# EAGLE design JoyPad (EAGLE 7.2.0)
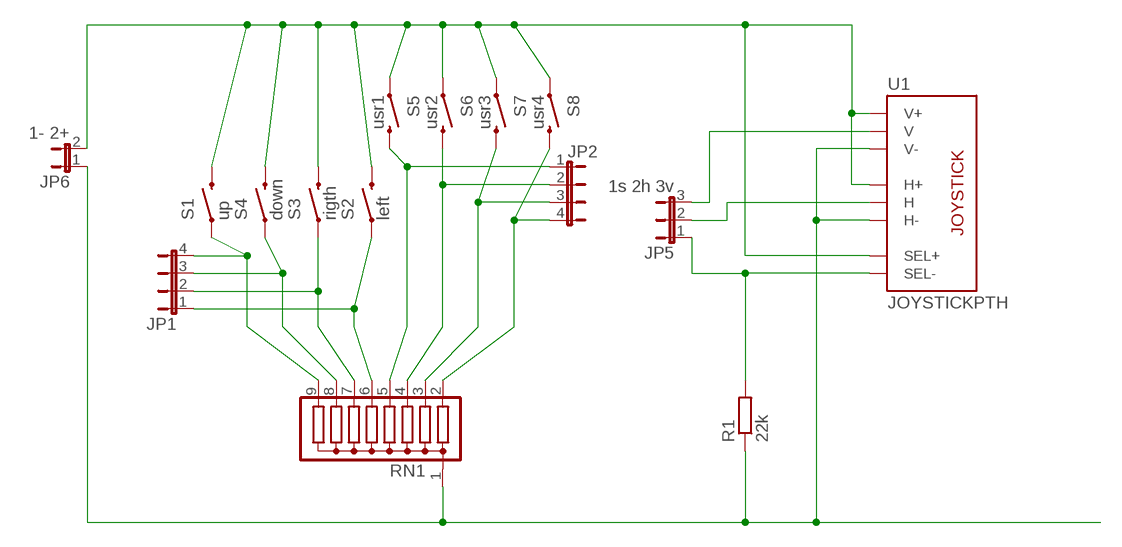
[diagram p0: schematic, sheet 1]

## Parts
JP1  JP4E  [JP4]
JP2  JP4E  [JP4]
JP5  1s 2h 3v  JP2E  [JP2]
JP6  1- 2+  JP1E  [JP1]
R1  22k  R-EU_0207/15  [0207/15]
RN1  G08R  [SIL9]
S1  up  SWITCH-MOMENTARY-2PTH  [TACTILE-PTH]
S2  left  SWITCH-MOMENTARY-2PTH  [TACTILE-PTH]
S3  rigth  SWITCH-MOMENTARY-2PTH  [TACTILE-PTH]
S4  down  SWITCH-MOMENTARY-2PTH  [TACTILE-PTH]
S5  usr1  SWITCH-MOMENTARY-2PTH  [TACTILE-PTH]
S6  usr2  SWITCH-MOMENTARY-2PTH  [TACTILE-PTH]
S7  usr3  SWITCH-MOMENTARY-2PTH  [TACTILE-PTH]
S8  usr4  SWITCH-MOMENTARY-2PTH  [TACTILE-PTH]
U1  JOYSTICKPTH  [JOYSTICK]

## Nets
N$2: JP6.1 R1.1 RN1.1 U1.H3(H-) U1.V3(V-)
N$3: JP1.4 RN1.9 S1.1
N$4: JP1.3 RN1.8 S4.1
N$5: JP1.2 RN1.7 S3.1
N$6: JP1.1 RN1.6 S2.1
N$7: JP2.1 RN1.5 S5.3
N$8: JP2.2 RN1.4 S6.3
N$9: JP2.3 RN1.3 S7.3
N$10: JP2.4 RN1.2 S8.3
N$11: JP6.2 S1.3 S2.3 S3.3 S4.3 S5.1 S6.1 S7.1 S8.1 U1.B1A(SEL+) U1.H1(H+) U1.V1(V+)
N$13: JP5.1 R1.2 U1.B2A(SEL-)
N$14: JP5.3 U1.V2(V)
N$15: JP5.2 U1.H2(H)

## Library data of the parts
JP1 JP2 = jumper:JP4E: JUMPER
JP5 = jumper:JP2E: JUMPER
JP6 = jumper:JP1E: JUMPER
R1 = rcl:R-EU_: RESISTOR, European symbol
RN1 = resistor-sil:G08R: SIL RESISTOR; OC_FARNELL: unknown; OC_NEWARK: unknown
S1-S8 = SparkFun-Electromechanical:SWITCH-MOMENTARY-2: Various NO switches- pushbuttons, reed, etc; PROD_ID: SWCH-08441
U1 = adafruit:JOYSTICK: Thumb Joystick Joystick commonly found in PS2 controllers. Two pots and a select switch. Adapted from Sparkfun Library (but for more common 6mm switch sticks)

## Board
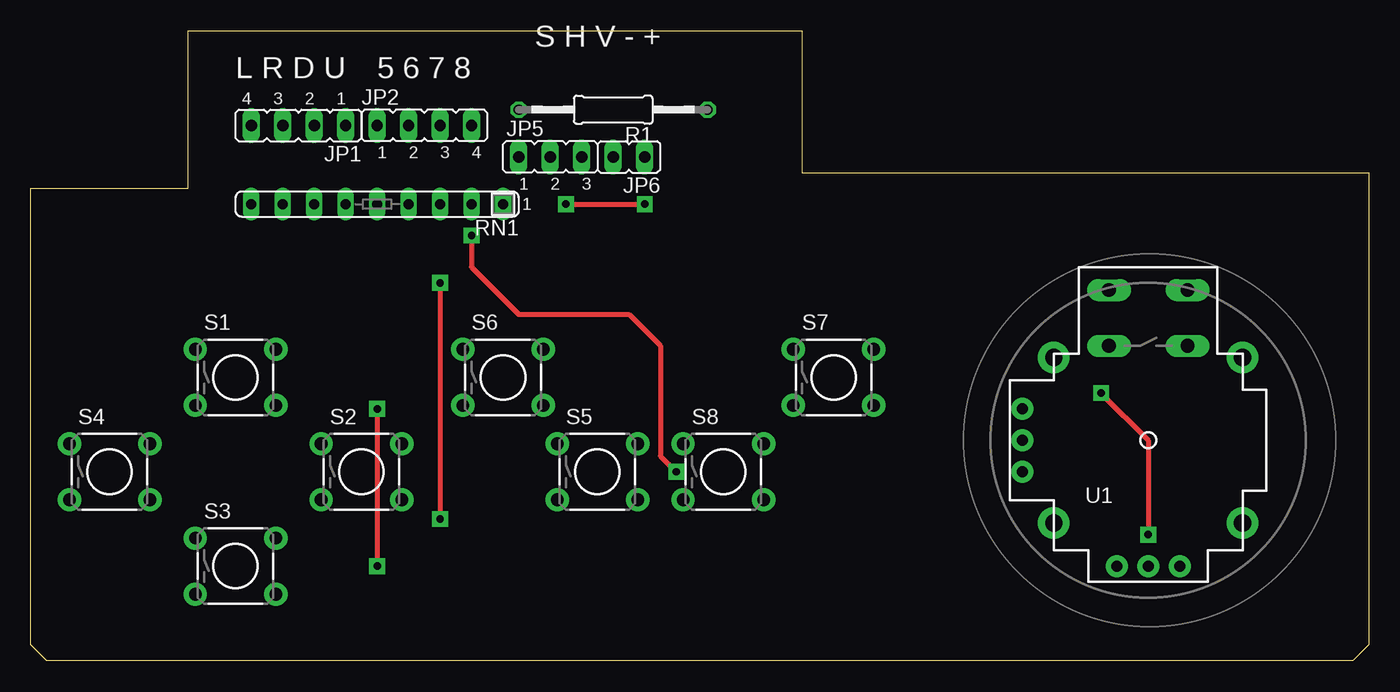
[diagram p1: board, top side]
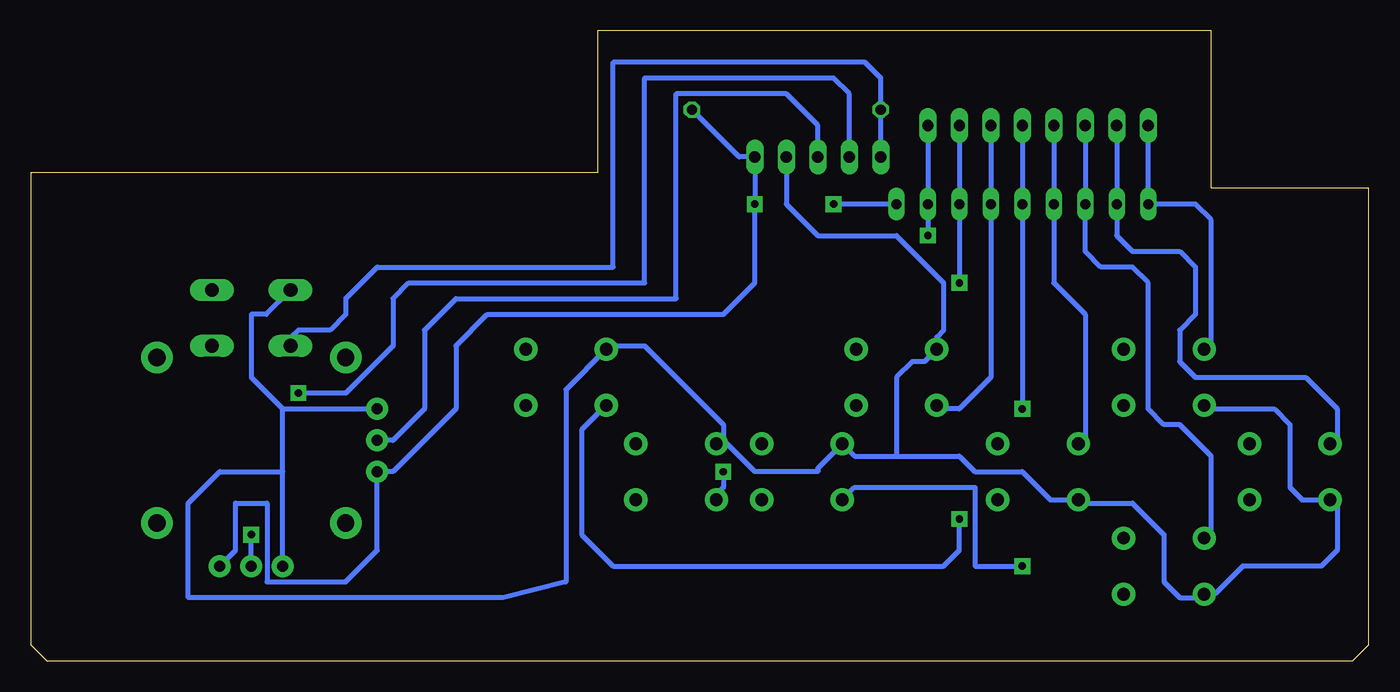
[diagram p2: board, bottom side, seen from below]

Size 107.95 x 50.8 mm. Coordinates in mm from the lower left corner, seen from the top.
Outline: 1.27,0 0,1.27 0,38.1 12.7,38.1 12.7,50.8 62.23,50.8 62.23,39.37 107.95,39.37 107.95,1.27 106.68,0 1.27,0
Copper layers (1*16): Top 0.035mm / dielectric 1.5mm / Bottom 0.035mm
Design rules "default": minimum track width 10mil, minimum drill 24mil, track to track 8mil, track to pad 8mil, pad to pad 8mil, via to via 8mil, smd to smd 8mil, copper to edge 40mil, drill to drill 8mil, minimum pad ring 10mil, minimum via ring 8mil, stop-mask expansion 4mil, vias tented up to drill 0mil, thermal gap 10mil

### Footprints (pad centres in the part's own frame; a part is rotated, then mirrored left to right if it is on the bottom)
JP4 = drill 0.914 long: 1 -3.81,0; 2 -1.27,0; 3 1.27,0; 4 3.81,0
JP2 = drill 0.914 long: 1 -2.54,0; 2 0,0; 3 2.54,0
JP1 = drill 0.914 long: 1 0,-1.27; 2 0,1.27
0207/15 = drill 0.813 octagon: 1 -7.62,0; 2 7.62,0
SIL9 = drill 0.813 long: 1 -10.16,0; 2 -7.62,0; 3 -5.08,0; 4 -2.54,0; 5 0,0; 6 2.54,0; 7 5.08,0; 8 7.62,0; 9 10.16,0
TACTILE-PTH = drill 1.016 pad 1.88: 1 -3.251,2.261; 2 3.251,2.261; 3 -3.251,-2.261; 4 3.251,-2.261
JOYSTICK = drill 1.1 pad 1.778 long: B1A -3.175,12.12; B1B 3.175,12.12; B2A -3.175,7.62; B2B 3.175,7.62 | drill 0.889 pad 1.778: H1 -2.54,-10.16; H2 0,-10.16; H3 2.54,-10.16; V1 -10.16,2.54; V2 -10.16,0; V3 -10.16,-2.54 | drill 1.397 pad 2.54: MOUNT1 -7.62,6.668; MOUNT2 -7.62,-6.668; MOUNT3 7.62,-6.668; MOUNT4 7.62,6.668

### Placement (x,y rotation side)
JP1  21.59,43.18 180 top
JP2  31.75,43.18 0 top
JP5  41.91,40.64 0 top
JP6  48.26,40.64 90 top
R1  46.99,44.45 180 top
RN1  27.94,36.83 180 top
S1  16.51,22.86 0 top
S2  26.67,15.24 0 top
S3  16.51,7.62 0 top
S4  6.35,15.24 0 top
S5  45.72,15.24 0 top
S6  38.1,22.86 0 top
S7  64.77,22.86 0 top
S8  55.88,15.24 0 top
U1  90.17,17.78 0 top

### Tracks (layer width: path | path; a pad name or v marks a point on that pad's centre or on a via)
N$2  (via drill 0.6 pad 1.27)
  Top 0.406: v43.18,36.83 v49.53,36.83
  Bottom 0.406: R1.1 50.8,40.64 JP6.1 v49.53,36.83 49.53,30.48 52.07,27.94 71.12,27.94 73.66,25.4 73.66,20.32 78.74,15.24 U1.V3 80.01,8.89 82.55,6.35 88.9,6.35 88.9,12.7 91.44,12.7 91.44,8.89 U1.H3 | RN1.1 v43.18,36.83
N$3
  Bottom 0.406: JP1.4 RN1.9 13.97,36.83 12.7,35.56 12.7,25.68 S1.1
N$4
  Bottom 0.406: JP1.3 RN1.8 20.32,34.29 19.05,33.02 15.24,33.02 13.97,31.75 13.97,27.94 15.24,26.67 15.24,24.13 13.97,22.86 5.08,22.86 2.54,20.32 2.54,17.78 2.82,17.5 S4.1
N$5
  Bottom 0.406: JP1.2 RN1.7 22.86,33.02 21.59,31.75 19.05,31.75 17.78,30.48 17.78,20.32 16.51,19.05 15.24,19.05 12.7,16.51 12.7,10.44 S3.1
N$6
  Bottom 0.406: JP1.1 RN1.6 25.4,30.48 22.86,27.94 22.86,17.78 23.14,17.5 S2.1
N$7  (via drill 0.6 pad 1.27)
  Top 0.406: v27.94,20.32 v27.94,7.62
  Bottom 0.406: JP2.1 RN1.5 v27.94,20.32 | S5.3 41.48,13.97 31.75,13.97 31.75,7.62 v27.94,7.62
N$8
  Bottom 0.406: JP2.2 RN1.4 30.48,22.86 33.02,20.32 34.29,20.32 34.57,20.6 S6.3
N$9  (via drill 0.6 pad 1.27)
  Top 0.406: v33.02,30.48 v33.02,11.43
  Bottom 0.406: JP2.3 RN1.3 v33.02,30.48 | S7.3 63.5,18.62 63.5,10.16 60.96,7.62 34.29,7.62 33.02,8.89 v33.02,11.43
N$10  (via drill 0.6 pad 1.27)
  Top 0.406: v35.56,34.29 35.56,31.75 39.37,27.94 48.26,27.94 50.8,25.4 50.8,16.51 v52.07,15.24
  Bottom 0.406: JP2.4 RN1.2 v35.56,34.29 | v52.07,15.24 52.07,13.97 52.63,13.41 S8.3
N$11
  Bottom 0.406: S1.3 12.98,20.32 7.62,20.32 6.35,19.05 6.35,13.97 5.36,12.98 S4.3 2.54,12.42 2.54,8.89 3.81,7.62 10.16,7.62 12.42,5.36 S3.3 12.98,5.36 12.7,5.08 15.24,5.08 16.51,6.35 16.51,10.16 19.05,12.7 23.14,12.7 S2.3 25.68,12.98 27.94,15.24 31.75,15.24 33.02,16.51 38.1,16.51 | 38.1,16.51 41.48,16.51 S5.1 44.45,15.52 44.45,15.24 49.53,15.24 51.79,17.5 52.07,17.5 | 38.1,16.51 38.1,22.86 36.83,24.13 35.84,24.13 S6.1 34.85,26.11 34.29,26.67 34.29,30.48 38.1,34.29 44.45,34.29 46.99,36.83 JP6.2 | 52.07,17.5 S8.1 | 52.07,17.5 52.07,19.05 58.42,25.4 61.24,25.4 S7.1 64.77,21.87 64.77,6.35 69.85,5.08 95.25,5.08 95.25,12.7 92.71,15.24 87.63,15.24 | U1.B1A 88.95,27.94 90.17,27.94 90.17,22.86 87.63,20.32 | 87.63,20.32 U1.V1 | U1.H1 87.63,15.24 | 87.63,15.24 87.63,20.32
N$13
  Bottom 0.406: R1.2 JP5.1 39.37,46.99 40.64,48.26 60.96,48.26 60.96,31.75 80.01,31.75 82.55,29.21 82.55,27.94 83.82,26.67 86.36,26.67 87,26.04 U1.B2A
N$14
  Bottom 0.406: JP5.3 44.45,43.18 46.99,45.72 55.88,45.72 55.88,29.21 73.66,29.21 76.2,26.67 76.2,20.32 78.74,17.78 U1.V2
N$15  (via drill 0.6 pad 1.27)
  Top 0.406: v86.36,21.59 90.17,17.78 v90.17,10.16
  Bottom 0.406: JP5.2 41.91,45.72 43.18,46.99 58.42,46.99 58.42,30.48 77.47,30.48 78.74,29.21 78.74,25.4 82.55,21.59 v86.36,21.59 | U1.H2 v90.17,10.16

### Text on the board
tNames: S H V - + | L R D U | 5 6 7 8